# Altium schematic sheet SY8003ADFC_2.SchDoc
size A4; SheetNumber: 12; SheetTotal: 16
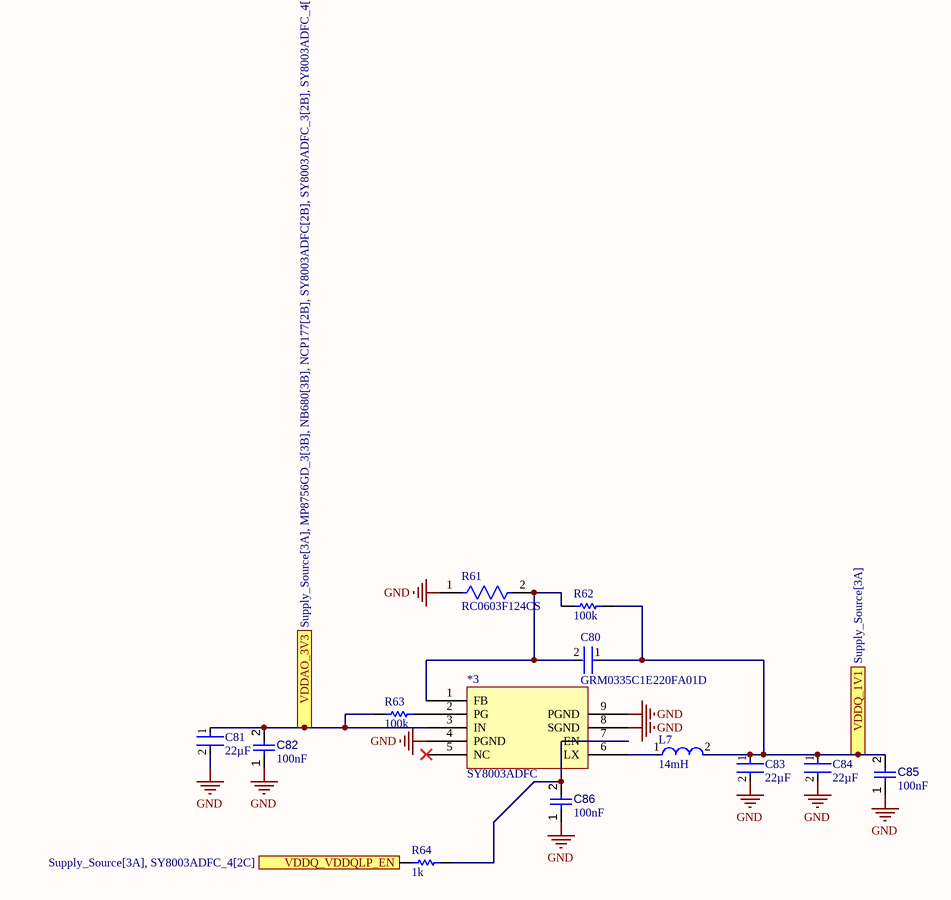
[diagram p0: SY8003ADFC_2.SchDoc]

## Parts
*3  SY8003ADFC  [SON127P750X265-8N]
C80  GRM0335C1E220FA01D  [FP-GRM033-0_03-IPC_C]
C81  value 22µF  [FP-GRM186-0_2-IPC_A]  (hidden comment: GRM186R60J226ME15D)
C82  value 100nF  [CAPC1005X56X25LL10T15]  (hidden comment: Capacitor 0.1 uF +/- 5% 16 V 0402)
C83  value 22µF  [FP-GRM186-0_2-IPC_A]  (hidden comment: GRM186R60J226ME15D)
C84  value 22µF  [FP-GRM186-0_2-IPC_A]  (hidden comment: GRM186R60J226ME15D)
C85  value 100nF  [CAPC1005X56X25LL10T15]  (hidden comment: Capacitor 0.1 uF +/- 5% 16 V 0402)
C86  value 100nF  [CAPC1005X56X25LL10T15]  (hidden comment: Capacitor 0.1 uF +/- 5% 16 V 0402)
L7  value 14mH  [FP-IHLP-2525CZ-FP_2_413x3-MFG]  (hidden comment: IHLP2525CZER1R5M01)
R61  RC0603F124CS  [FP-RC0603-MFG]
R62  value 100k  [RESC0603X26X15NL03T05]  (hidden comment: CRG0201F100K)
R63  value 100k  [RESC0603X26X15NL03T05]  (hidden comment: CRG0201F100K)
R64  value 1k  [RESC0603X26X15NL03T05]  (hidden comment: MCRE000140)

## Ports
VDDAO_3V3 (see Supply_Source[3A], MP8756GD_3[3B], NB680[3B], NCP177[2B], SY8003ADFC[2B], SY8003ADFC_3[2B], SY8003ADFC_4[2C], TLV76701[1B]), VDDQ_1V1 (see Supply_Source[3A]), VDDQ_VDDQLP_EN (see Supply_Source[3A], SY8003ADFC_4[2C])

## Nets
GND: *3.4(PGND) *3.8(SGND) *3.9(PGND) C81.2 C82.1 C83.2 C84.2 C85.1 C86.1 R61.1
VDDAO_3V3: *3.3(IN) C81.1 C82.2 R63.1 ; port VDDAO_3V3
VDDQ_1V1: C80.1 C83.1 C84.1 C85.2 L7.2 R62.2 ; port VDDQ_1V1
VDDQ_VDDQLP_EN: R64.1 ; port VDDQ_VDDQLP_EN
Net*3_1: *3.1(FB) C80.2 R61.2 R62.1
Net*3_2: *3.2(PG) R63.2
Net*3_6: *3.6(LX) L7.1
Net*3_7: *3.7(EN) C86.2 R64.2

Not connected (* = marked no-connect by the designer): *3 5(NC)*

## Library data of the parts
*3 = CMP-019-00056-1: Switching Regulator, 3A, 1200kHz Switching Freq-Max, PDSO8; Max Supply Voltage: 5.5V; Max Operating Temperature: 85°C; Min Operating Temperature: -40°C
C80 = CMP-06035-000754-1: Chip Multilayer Ceramic Capacitors for General Purpose, 0201, 22pF, C0G, 30ppm/°C, 1%, 25V; Voltage Rating (DC): 25V; Tolerance: 1%; Package Quantity: 15000; Case Code (Imperial): 0201; Termination: SMD/SMT; Thickness: 0.013inch; Min Operating Temperature: -55°C; Packaging: Tape and Reel; Length: 0.024inch; Case/Package: 0201; Mount: Surface Mount; Capacitance: 22pF; Case Code (Metric): 0603; Width: 0.012inch; Dielectric: C0G; Voltage Rating: 25V; Max Operating Temperature: 125°C; Height: 0.3mm
C81 C83 C84 = CMP-001-00097-1: 6.3V 22uF X5R ±20% 0603 Multilayer Ceramic Capacitors MLCC - SMD/SMT ROHS; Mounting Technology: Surface Mount; Tolerance: 20%; Max Operating Temperature: 85°C; Case/Package: 0603; Voltage Rating: 6.3V; Min Operating Temperature: -55°C
C82 C85 C86 = CMP-001-00001-6: Chip Capacitor, 0.1 uF, +/- 5%, 16 V, 0402 (1005 Metric); Capacitor Type: Ceramic; Voltage Rating: 16V; Max Operating Temperature: 125°C; Min Operating Temperature: -55°C; Case/Package: 0402; Mounting Technology: SM; Pins: 2; Tolerance: 5%; RoHS Compliant: True
L7 = CMP-006-00023-1: Inductor High Current Shielded Wirewound 1.5uH 20% 100KHz 9A 15mOhm DCR 2525 T/R; Self Resonant Frequency: 40MHz; Tolerance: 20%; Current Rating: 9A; Mounting Technology: Surface Mount; Max Current Rating: 9A; Min Operating Temperature: -55°C; Case/Package: 2525; Pins: 2; Max Operating Temperature: 125°C
R61 = CMP-13261-004037-1: Res Thick Film 0201 120kΩ 1% 0.05W ±250ppm/°C Molded SMD T/R; Voltage Rating (DC): 25V; Max Power Dissipation: 50mW; Resistance: 120kR; Case Code (Metric): 0603; Case Code (Imperial): 0201; Height: 0.01inch; Features: Moisture Resistant; Radiation Hardening: No; Width: 0.012inch; Temperature Coefficient: 250ppm/°C; Case/Package: 0201; Length: 0.024inch; Number of Terminations: 2; Lead Free: Lead Free; Min Operating Temperature: -55°C; Tolerance: 1%; Composition: Thick Film; Packaging: Tape and Reel; Contact Plating: Tin; Max Operating Temperature: 125°C
R62 R63 = CMP-009-00205-1: Res General Purpose Thick Film 0201 100k Ohm 1% 1/20W ±200ppm/°C Molded Paper T/R; Voltage Rating: 25V; Case/Package: 0201; Min Operating Temperature: -55°C; Max Operating Temperature: 155°C; Mounting Technology: Surface Mount; Tolerance: 1%
R64 = CMP-009-00208-1: Res General Purpose Thick Film 0201 1k Ohm 1% 1/20W ±200ppm/°C Molded Paper T/R; Voltage Rating: 25V; Case/Package: 0201; Min Operating Temperature: -55°C; Max Operating Temperature: 125°C; Tolerance: 1%